# Altium schematic sheet Alarm.SchDoc
size A
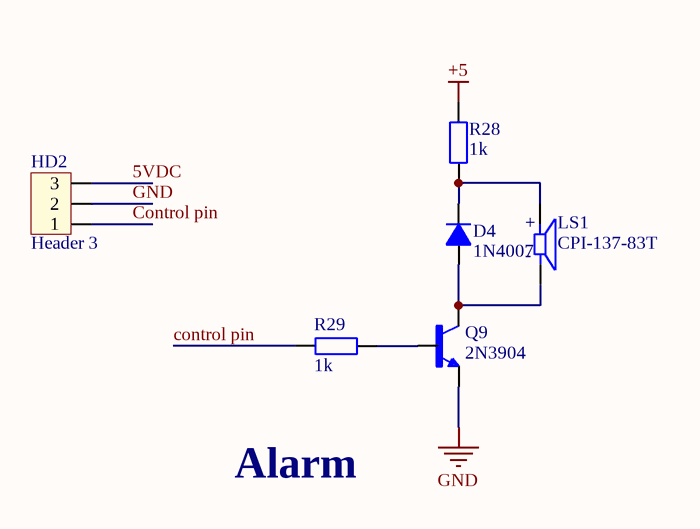
[diagram p0: Alarm.SchDoc]

## Parts
D4  1N4007  [D1A]
HD2  Header 3  [HED3]
LS1  CPI-137-83T  [XDCR_CPI-137-83T]
Q9  2N3904  [TO92127P495H495-3]
R28  1k  [R1/4W]
R29  1k  [R1/4W]

## Nets
+5: R28.2
GND: HD2.2 Q9.1(E)
5VDC: HD2.3
control pin: HD2.1 R29.1
NetD4_1: D4.1(A) LS1.N Q9.3(C)
NetD4_2: D4.2(K) LS1.P R28.1
NetQ9_2: Q9.2(B) R29.2

## Notes on the sheet
- Alarm
- (in symbol CPI-137-83T) +; -

## Library data of the parts
D4 = D1A: Diode 1A; Value: 1N4007
HD2 = Hed3: Header 3 (Green); Value: Header 3
LS1 = CPI-137-83T: 13.9 mm, 5 Vdc, 83 dB, Through Hole, Driving Circuit, Piezo Audio Indicator Buzzer; MF: CUI Devices; Digi-Key_Part_Number: 2223-CPI-137-83T-ND; SnapEDA_Link: https://www.snapeda.com/parts/CPI-137-83T/CUI%20Devices/view-part/4502141/?ref=snap; Value: *; Digi-Key_Purchase_URL: https://www.digikey.com/product-detail/en/cui-devices/CPI-137-83T/2223-CPI-137-83T-ND/11480414?utm_source=snapeda&utm_medium=aggregator&utm_campaign=symbol; Package: CUI Devices; MP: CPI-137-83T; CUI_purchase_URL: https://www.cuidevices.com/product/audio/buzzers/audio-indicators/cpi-137-83t?utm_source=snapeda.com&utm_medium=referral&utm_campaign=snapedaBOM
Q9 = 2N3904: Bipolar _BJT_ Transistor NPN 40V 200mA 270MHz 625mW Through Hole TO-92-3; MF: MICROSS/On Semiconductor; Package: TO-92 Continental Device; Availability: Unavailable; MP: 2N3904; Value: *; SnapEDA_Link: https://www.snapeda.com/parts/2N3904/MICROSS/On%20Semiconductor/view-part/799649/?ref=snap; Price: None
R28 R29 = R1/4W: Resistor 1/4W; Value: R1/4W - 1K